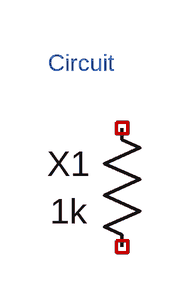
[diagram p0: schematic circuit.asc]
circuit.asc, the LTspice schematic file:
Version 4
SHEET 1 144 208
SYMBOL res 64 128 R0
WINDOW 0 -20 40 Center 2
WINDOW 3 -20 72 Center 2
SYMATTR InstName X1
SYMATTR Value 1k
TEXT 30 100 Left 1 ;Circuit

The netlist it stands for:
* circuit.asc
R§X1 NC_01 NC_02 1k
* Circuit
.backanno
.end